# Altium schematic sheet ADCwHarness.SchDoc: ADC with Harness
size A; Author: Max Bakes; CompanyName: BYUI; DrawnBy: Max Bakes; Engineer: Max Bakes; Organization: CSEE; DocumentNumber: 1; Revision: 0.0.1; SheetNumber: 1; SheetTotal: 15
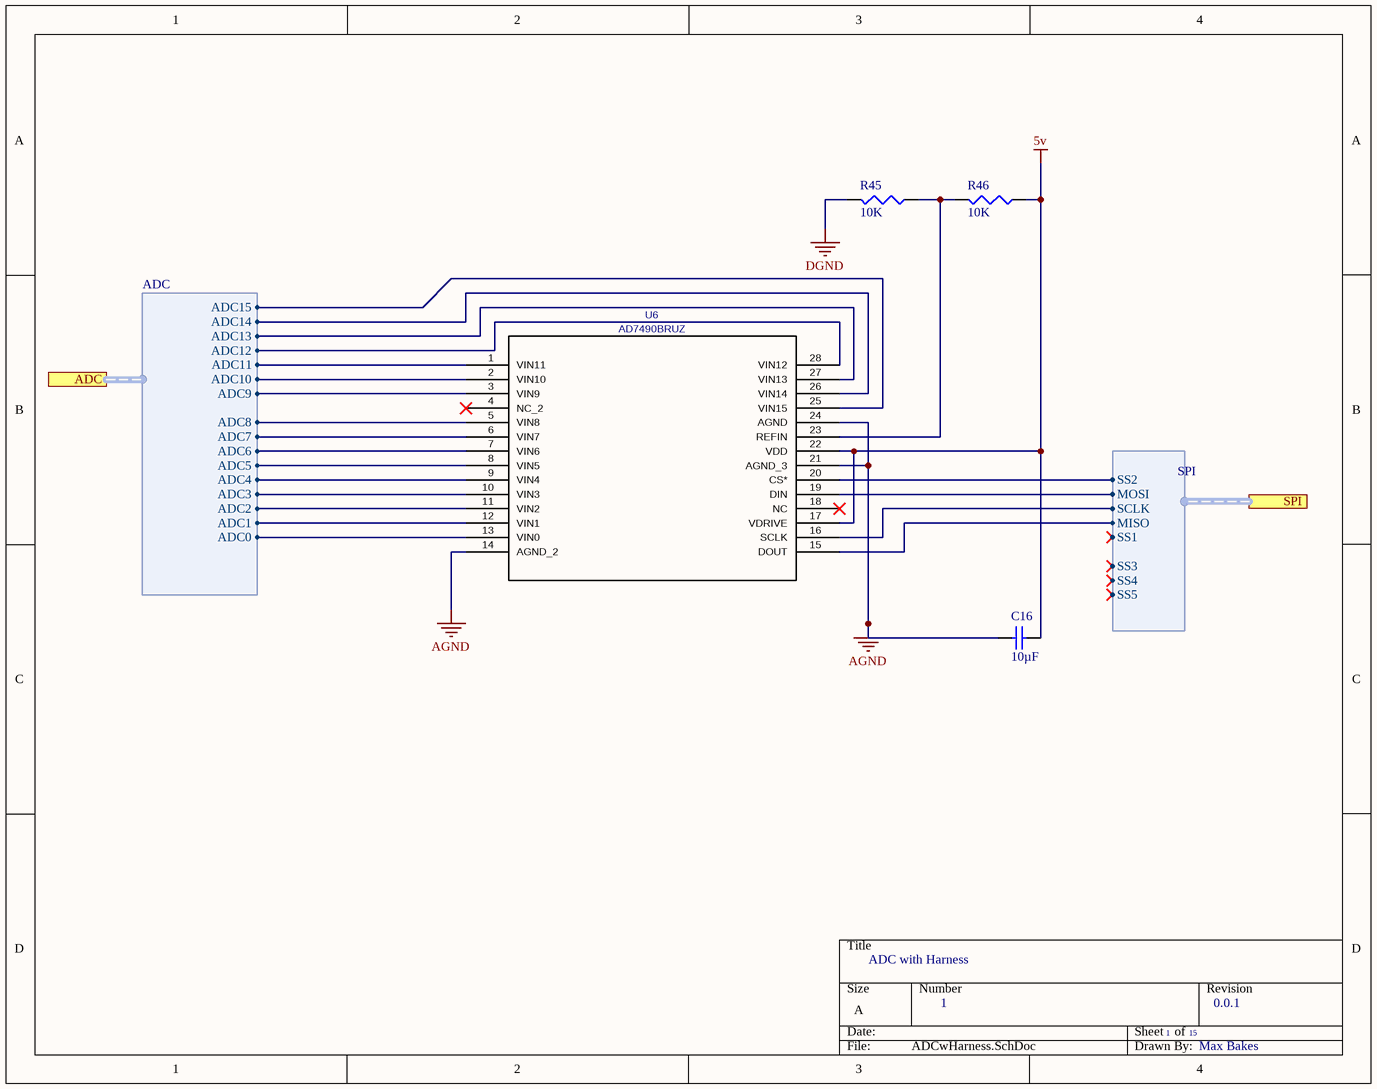
[diagram p0: ADCwHarness.SchDoc]

## Parts
C16  Capacitance: 10µF  [CAPC1608X90X20LL10]  (hidden comment: C1608X5R1A106K080AC)
R45  value 10K  [J1-0603]  (hidden comment: Res3)
R46  value 10K  [J1-0603]  (hidden comment: Res3)
U6  AD7490BRUZ  [*SOP65P640X120-28N]

## Ports
ADC (harness ADC), SPI (harness SPI)

## Harnesses
ADC: ADC15, ADC14, ADC13, ADC12, ADC11, ADC10, ADC9, ADC8, ADC7, ADC6, ADC5, ADC4, ADC3, ADC2, ADC1, ADC0
SPI: SCLK, MOSI, MISO, SS5, SS2, SS3, SS1, SS4

## Nets
5v: C16.2 R46.1 U6.17(VDRIVE) U6.22(VDD)
AGND: C16.1 U6.14(AGND_2) U6.21(AGND_3) U6.24(AGND)
DGND: R45.2
NetR45_1: R45.1 R46.2 U6.23(REFIN)
NetU6_1: U6.1(VIN11) ; port ADC.ADC11
NetU6_2: U6.2(VIN10) ; port ADC.ADC10
NetU6_3: U6.3(VIN9) ; port ADC.ADC9
NetU6_5: U6.5(VIN8) ; port ADC.ADC8
NetU6_6: U6.6(VIN7) ; port ADC.ADC7
NetU6_7: U6.7(VIN6) ; port ADC.ADC6
NetU6_8: U6.8(VIN5) ; port ADC.ADC5
NetU6_9: U6.9(VIN4) ; port ADC.ADC4
NetU6_10: U6.10(VIN3) ; port ADC.ADC3
NetU6_11: U6.11(VIN2) ; port ADC.ADC2
NetU6_12: U6.12(VIN1) ; port ADC.ADC1
NetU6_13: U6.13(VIN0) ; port ADC.ADC0
NetU6_15: U6.15(DOUT) ; port SPI.MISO
NetU6_16: U6.16(SCLK) ; port SPI.SCLK
NetU6_19: U6.19(DIN) ; port SPI.MOSI
NetU6_20: U6.20(CS*) ; port SPI.SS2
NetU6_25: U6.25(VIN15) ; port ADC.ADC15
NetU6_26: U6.26(VIN14) ; port ADC.ADC14
NetU6_27: U6.27(VIN13) ; port ADC.ADC13
NetU6_28: U6.28(VIN12) ; port ADC.ADC12

Not connected (* = marked no-connect by the designer): U6 4(NC_2)* 18(NC)*

## Library data of the parts
C16 = CMP-2000-04979-1: Chip Capacitor, 10 uF, +/- 10%, 10 V, -55 to 85 degC, 0603 (1608 Metric), RoHS, Tape and Reel; PCN Part Number: MLCCPartNumberChange30/Nov/2012; Manufacturer: TDK; Temperature Coefficient: X5R; Product Training Modules: CSeriesGeneralApplicationsSEAT,CCV,andTVCLDesignToolsGuidetoReplacinganElectrolyticCapacitorwithanMLCC; Online Catalog: CSeries,GeneralPurpose; Voltage - Rated: 10V; Other Names: 445-7486-1; Design Resources: 20WNon-IsolatedBuckLEDDriverUsingPLLNK460KG; Kits: 445-9003-KIT-ND-KITCAPCERHICAPMLCCSMD; Height - Seated (Max): -; Family: CeramicCapacitors; Package Description: 2-Pin Surface Mount Device, Body 1.6 x 0.8 mm; Category: Capacitors; Datasheet Version: Mar-15; RoHS Information: RoHSCertificate-MLCC; Thickness (Max): 0.035"(0.90mm); Operating Temperature: -55degC~85degC; Package Reference: 603; Series: C; Applications: GeneralPurpose; Datasheet URL: http://download.siliconexpert.com/pdfs/2015/4/21/15/54/45/779/tdk_/manual/37024850441143360mlcc_commercial_general_en.pdf; Features: -; Lead Style: -; Lead Spacing: -; Ratings: -; Size / Dimension: 0.063"Lx0.031"W(1.60mmx0.80mm); Tolerance: ±10%; Mounting Type: SurfaceMount,MLCC; Standard Package: 1; Package / Case: 0603(1608Metric); Manufacturer URL: http://www.tdk.com/; Packaging: CutTape(CT); Manufacturer Part Number: C1608X5R1A106K080AC
R45 R46 = Res3: Resistor; Published: 8-Jun-2000; LatestRevisionDate: 29-May-2009; LatestRevisionNote: IPC-7351 Footprint Added.; PackageReference: J1-0603; Publisher: Altium Limited; PackageDescription: Chip Resistor
U6 = AD7490BRUZ: 16-Channel, 1 MSPS, 12-Bit ADC / with Sequencer in 28-Lead TSSOP; C: Copyright (C) 2015 Accelerated Designs. All rights reserved; Vendor: Analog Devices Inc; Built_By: EMA_UL_Team; Value: AD7490BRUZ; Manufacturer_Part_Number: AD7490BRUZ